# Altium schematic sheet RoBeast_UI.SchDoc: User Interface
size A4; ApprovedBy: CR; DrawnBy: VM & IG; Revision: V1; SheetNumber: 2; SheetTotal: 9
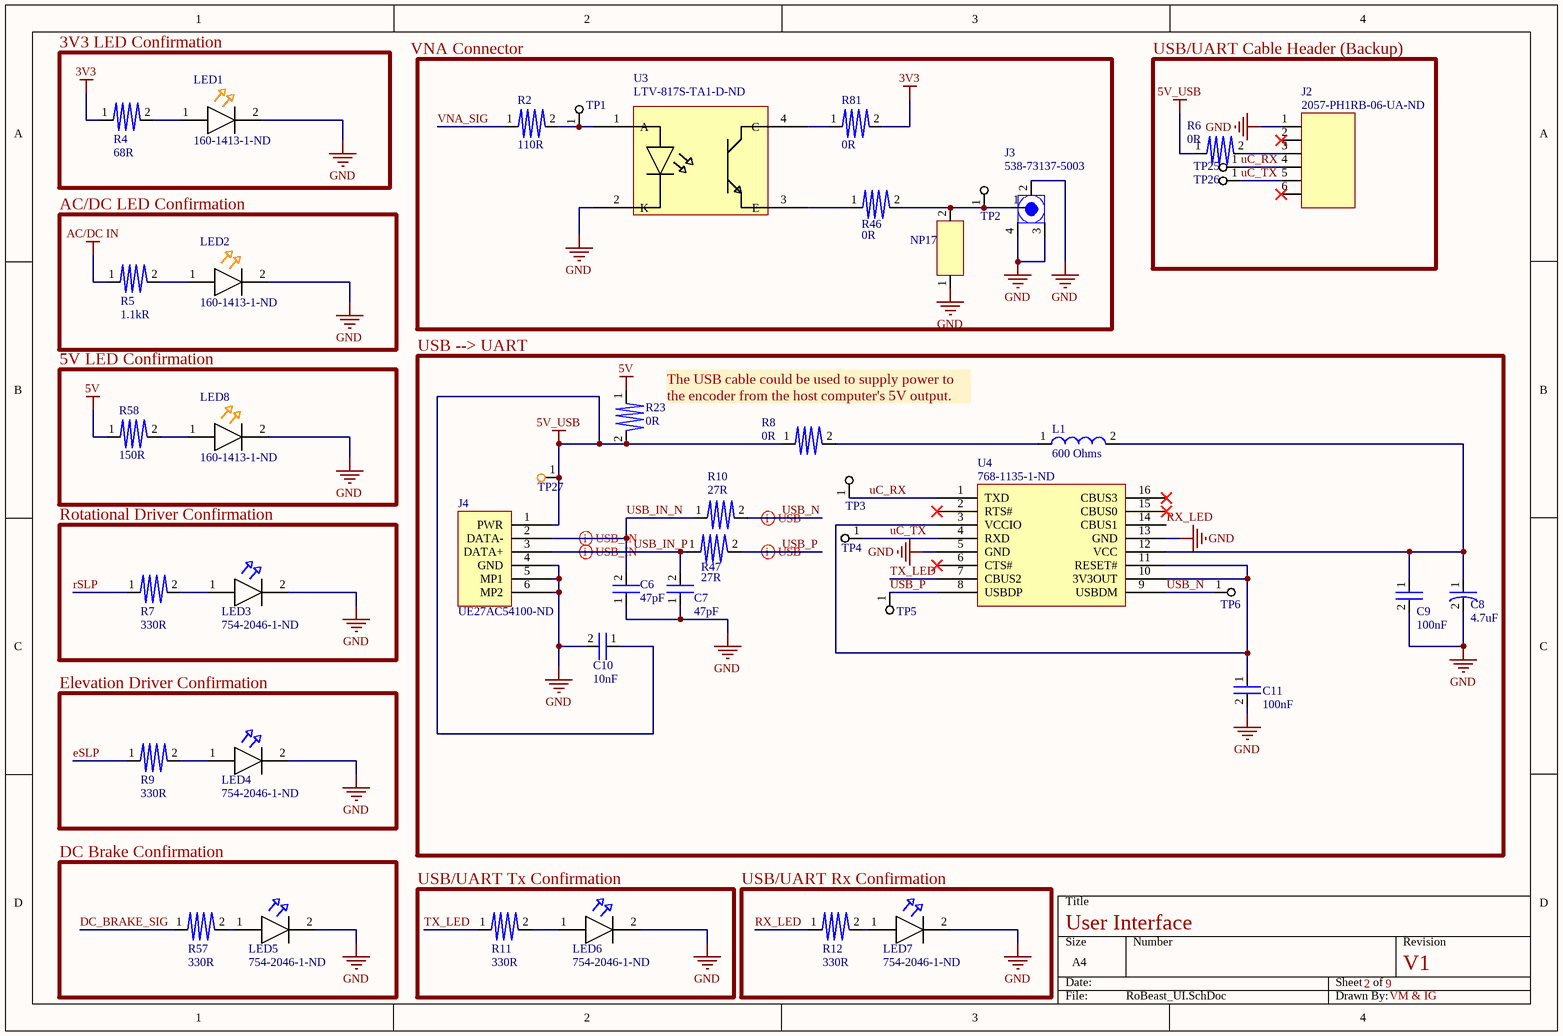
[diagram p0: RoBeast_UI.SchDoc]

## Parts
C6  47pF  [0805]
C7  47pF  [0805]
C8  4.7uF  [EDK475M050A9DAA]
C9  100nF  [0805]
C10  10nF  [0805]
C11  100nF  [0805]
J2  Supplier Part Number 1: 2057-PH1RB-06-UA-ND  [PH1RB-06-UA]  (hidden comment: 6 Pin Connector)
J3  Supplier Part Number 1: 538-73137-5003  [0731375003]  (hidden comment: BNC Connector)
J4  Supplier Part Number 1: UE27AC54100-ND  [UE27AC54100]  (hidden comment: USB Connector)
L1  600 Ohms  [0805]
LED1  Supplier Part Number 1: 160-1413-1-ND  [0805_LED]  (hidden comment: Orange LED)
LED2  Supplier Part Number 1: 160-1413-1-ND  [0805_LED]  (hidden comment: Orange LED)
LED3  Supplier Part Number 1: 754-2046-1-ND  [0805_LED]  (hidden comment: Blue LED)
LED4  Supplier Part Number 1: 754-2046-1-ND  [0805_LED]  (hidden comment: Blue LED)
LED5  Supplier Part Number 1: 754-2046-1-ND  [0805_LED]  (hidden comment: Blue LED)
LED6  Supplier Part Number 1: 754-2046-1-ND  [0805_LED]  (hidden comment: Blue LED)
LED7  Supplier Part Number 1: 754-2046-1-ND  [0805_LED]  (hidden comment: Blue LED)
LED8  Supplier Part Number 1: 160-1413-1-ND  [0805_LED]  (hidden comment: Orange LED)
NP17  Not Populated  [0805]  (value not drawn)
R2  110R  [0805]
R4  68R  [0805]
R5  1.1kR  [0805]
R6  0R  [0805]
R7  330R  [0805]
R8  0R  [0805]
R9  330R  [0805]
R10  27R  [0805]
R11  330R  [0805]
R12  330R  [0805]
R23  0R  [0805]
R46  0R  [0805]
R47  27R  [0805]
R57  330R  [0805]
R58  150R  [0805]
R81  0R  [0805]
TP1  Test Point  [RCWCTE]  (value not drawn)
TP2  Test Point  [RCWCTE]  (value not drawn)
TP3  Test Point  [RCWCTE]  (value not drawn)
TP4  Test Point  [RCWCTE]  (value not drawn)
TP5  Test Point  [RCWCTE]  (value not drawn)
TP6  Test Point  [RCWCTE]  (value not drawn)
TP25  Test Point  [RCWCTE]  (value not drawn)
TP26  Test Point  [RCWCTE]  (value not drawn)
TP27  Test Point  [Test Point]  (value not drawn)
U3  Supplier Part Number 1: LTV-817S-TA1-D-ND  [LTV-817S-TA]  (hidden comment: Optoisolator)
U4  Supplier Part Number 1: 768-1135-1-ND  [FT230XS-R]  (hidden comment: USB/UART Converter)

## Blocks framed on the sheet
3V3 LED Confirmation: LED1 R4
USB/UART Cable Header (Backup): J2 R6 TP25 TP26
AC/DC LED Confirmation: LED2 R5
5V LED Confirmation: LED8 R58
USB --> UART: C6-C11 J4 L1 R8 R10 R23 R47 TP3-TP6 TP27 U4
Rotational Driver Confirmation: LED3 R7
Elevation Driver Confirmation: LED4 R9
DC Brake Confirmation: LED5 R57
USB/UART Tx Confirmation: LED6 R11
USB/UART Rx Confirmation: LED7 R12

## Nets
3V3: R4.1 R81.2
5V: R23.1 R58.1
5V_USB: C10.1 J4.1(PWR) R6.1 R8.1 R23.2 TP27.1
AC/DC IN: R5.1
GND: C6.1 C7.1 C8.2 C9.2 C10.2 C11.2 J2.1 J3.2(GND) J3.3(SUP) J3.4(SUP) J4.4(GND) J4.5(MP1) J4.6(MP2) LED1.2(K) LED2.2(K) LED3.2(K) LED4.2(K) LED5.2(K) LED6.2(K) LED7.2(K) LED8.2(K) NP17.1 U3.2(K) U4.5(GND) U4.13(GND)
DC_BRAKE_SIG: R57.1
eSLP: R9.1
rSLP: R7.1
RX_LED: R12.1 U4.14(CBUS1)
TX_LED: R11.1 U4.7(CBUS2)
uC_RX: J2.4 TP3.1 TP25.1 U4.1(TXD)
uC_TX: J2.5 TP4.1 TP26.1 U4.4(RXD)
USB_IN_N: C6.2 J4.2(DATA-) R10.1
USB_IN_P: C7.2 J4.3(DATA+) R47.1
USB_N: R10.2 TP6.1 U4.9(USBDM)
USB_P: R47.2 TP5.1 U4.8(USBDP)
VNA_SIG: R2.1
NetC8_1: C8.1 C9.1 L1.2 U4.12(VCC)
NetC11_1: C11.1 U4.3(VCCIO) U4.10(3V3OUT) U4.11(RESET#)
NetJ2_3: J2.3 R6.2
NetJ3_1: J3.1(SIGN) NP17.2 R46.2 TP2.1
NetL1_1: L1.1 R8.2
NetLED1_1: LED1.1(A) R4.2
NetLED2_1: LED2.1(A) R5.2
NetLED3_1: LED3.1(A) R7.2
NetLED4_1: LED4.1(A) R9.2
NetLED5_1: LED5.1(A) R57.2
NetLED6_1: LED6.1(A) R11.2
NetLED7_1: LED7.1(A) R12.2
NetLED8_1: LED8.1(A) R58.2
NetR2_2: R2.2 TP1.1 U3.1(A)
NetR46_1: R46.1 U3.3(E)
NetR81_1: R81.1 U3.4(C)

Not connected (* = marked no-connect by the designer): J2 2* 6*; U4 2(RTS#)* 6(CTS#)* 15(CBUS0)* 16(CBUS3)*

## Layout directives
differential pair: USB_IN_N, USB_IN_P, USB_N, USB_P

## Notes on the sheet
- VNA Connector
- The USB cable could be used to supply power to the encoder from the host computer's 5V output.

## Library data of the parts
C6 C7 = C0805C470J5GAC7210: Ceramic Capacitor, Multilayer, Ceramic, 50V, 5% +Tol, 5% -Tol, C0G, 30ppm/Cel TC, 0.000047uF, Surface Mount, 0805; Manufacturer: KEMET; Supplier 1: Digikey; Manufacturer Part Number: C0805C470J5GAC7210; RoHS: Yes; Category: Ceramic Capacitors; Stock 1: 22724; Pricing 1: 1=0.1, 10=0.054, 50=0.031, 100=0.024, 500=0.01802, 1000=0.01417, 2500=0.01288, 5000=0.01185 (USD); Number of Pins: 2; Dielectric Material: Ceramic; Terminal Finish: Nickel; JESD-609 Code: e3; Capacitor Type: Ceramic; Reach SVHC Compliant: Yes; RoHS Compliant: Yes; ComponentLink1URL: https://datasheet.ciiva.com:443/pdfs/VipMasterIC/IC/KEME/KEME-S-A0005605168/KEME-S-A0005605168-1.pdf?src-supplier=IHS+Markit; ComponentLink1Description: https://datasheet.ciiva.com:443/pdfs/VipMasterIC/IC/KEME/KEME-S-A0005605168/KEME-S-A0005605168-1.pdf?src-supplier=IHS+Markit; ComponentLink2URL: https://datasheet.ciiva.com/11646/kem-c1003-c0g-smd-11646575.pdf?src-supplier=Avnet; ComponentLink2Description: https://datasheet.ciiva.com/11646/kem-c1003-c0g-smd-11646575.pdf?src-supplier=Avnet; Supplier Part Number 1: 399-C0805C470J5GAC7210CT-ND
C8 = EDK475M050A9DAA: Aluminum Electrolytic Capacitor, Polarized, Aluminum (wet), 50V, 20% +Tol, 20% -Tol, 4.7uF, Surface Mount, 2121; Manufacturer: KEMET; Dielectric Material: Aluminium; Leakage Current: 3uA; Ripple Current: 23mA; Tan Delta: 0.12; Supplier 1: Digikey; Manufacturer Part Number: EDK475M050A9DAA; RoHS: Yes; Category: Aluminum Electrolytic Capacitors; Stock 1: 9685; Pricing 1: 1=0.7, 10=0.493, 50=0.4154, 100=0.3383, 500=0.2819 (USD); Mount: Surface Mount; Number of Pins: 2; Package Shape: Cylindrical; Size Code: 2621; Min Operating Temperature: -40°C; Max Operating Temperature: 85°C; Polarity: Polarized; Capacitance: 4.7uF; Capacitor Type: Aluminium; Negative Tolerance: 20%; Package Style: SMTMeter; Packaging: Tape and Reel; Positive Tolerance: 20%; Rated DC Voltage (URdc): 50V; Termination: Flat; Length: 6.5mm; Width: 5.3mm; Height: 5.4mm; Reach SVHC Compliant: Yes; RoHS Compliant: Yes; ComponentLink1URL: https://datasheet.ciiva.com:443/pdfs/VipMasterIC/IC/KEME/KEME-S-A0008611145/KEME-S-A0008611145-1.pdf?src-supplier=IHS+Markit; ComponentLink1Description: https://datasheet.ciiva.com:443/pdfs/VipMasterIC/IC/KEME/KEME-S-A0008611145/KEME-S-A0008611145-1.pdf?src-supplier=IHS+Markit; ComponentLink2URL: http://www.mouser.com/ds/2/212/KEM_A4001_EDK-535350.pdf?src-supplier=Mouser; ComponentLink2Description: http://www.mouser.com/ds/2/212/KEM_A4001_EDK-535350.pdf?src-supplier=Mouser; ComponentLink3URL: https://search.kemet.com/component-edge/download/datasheet/EDK475M050A9DAA.pdf?src-supplier=Digikey; ComponentLink3Description: https://search.kemet.com/component-edge/download/datasheet/EDK475M050A9DAA.pdf?src-supplier=Digikey; Supplier Part Number 1: 399-6687-1-ND
C9 C11 = C0805C104J5RAC7800: Ceramic Capacitor, Multilayer, Ceramic, 50V, 5% +Tol, 5% -Tol, X7R, 15% TC, 0.1uF, Surface Mount, 0805; Manufacturer: KEMET; Manufacturer Part Number: C0805C104J5RACTU; Multilayer: Yes; Supplier 1: Digikey; RoHS: Yes; Category: Ceramic Capacitors; Stock 1: 605061; Pricing 1: 1=0.18, 10=0.122, 50=0.0732, 100=0.0576, 500=0.04252, 1000=0.03519 (USD); Mount: Surface Mount; Number of Pins: 2; Dielectric Material: Ceramic; Package Shape: Rectangular; Size Code: 0805; Terminal Finish: Nickel; Min Operating Temperature: -55°C; Max Operating Temperature: 125°C; JESD-609 Code: e3; Capacitor Type: Ceramic; Negative Tolerance: 5%; Packaging: Tape and Reel; Positive Tolerance: 5%; Rated DC Voltage (URdc): 50V; Temperature Characteristics Code: X7R; Termination: Wraparound; Reach SVHC Compliant: Yes; RoHS Compliant: Yes; ComponentLink1URL: http://capacitoredge.kemet.com:80/capedge2/intellispec.jsp?pn=C0805C104J5RACTU&displayPN=C0805C104J5RACTU&src-supplier=IHS+Markit; ComponentLink1Description: http://capacitoredge.kemet.com:80/capedge2/intellispec.jsp?pn=C0805C104J5RACTU&displayPN=C0805C104J5RACTU&src-supplier=IHS+Markit; ComponentLink2URL: https://datasheet.ciiva.com/7842/1732721-7842179.pdf?src-supplier=Element14; ComponentLink2Description: https://datasheet.ciiva.com/7842/1732721-7842179.pdf?src-supplier=Element14; ComponentLink3URL: https://datasheet.ciiva.com/28682/1851736-28682223.pdf?src-supplier=Element14; ComponentLink3Description: https://datasheet.ciiva.com/28682/1851736-28682223.pdf?src-supplier=Element14; ComponentLink4URL: https://datasheet.ciiva.com/7258/1828800-7258413.pdf?src-supplier=Newark; ComponentLink4Description: https://datasheet.ciiva.com/7258/1828800-7258413.pdf?src-supplier=Newark; ComponentLink5URL: https://datasheet.ciiva.com/14589/70095383-14589015.pdf?src-supplier=Allied+Electronics; ComponentLink5Description: https://datasheet.ciiva.com/14589/70095383-14589015.pdf?src-supplier=Allied+Electronics; ComponentLink6URL: https://datasheet.ciiva.com/5417/kem-c1002-x7r-smd-5417352.pdf?src-supplier=Mouser; ComponentLink6Description: https://datasheet.ciiva.com/5417/kem-c1002-x7r-smd-5417352.pdf?src-supplier=Mouser; ComponentLink7URL: https://datasheet.ciiva.com/39122/docfinderpartnumberc0402c102k5ractu-39122924.pdf?src-supplier=Onlinecomponents.com; ComponentLink7Description: https://datasheet.ciiva.com/39122/docfinderpartnumberc0402c102k5ractu-39122924.pdf?src-supplier=Onlinecomponents.com; Supplier Part Number 1: 399-C0805C104J5RAC7800CT-ND; Capacitance: 100nF
C10 = C0805C103J5RAC7210: Ceramic Capacitor, Multilayer, Ceramic, 50V, 5% +Tol, 5% -Tol, X7R, 15% TC, 0.01uF, Surface Mount, 0805; Manufacturer: KEMET; Multilayer: Yes; Supplier 1: Digikey; Manufacturer Part Number: C0805C103J5RAC7210; RoHS: Yes; Category: Ceramic Capacitors; Stock 1: 247971; Pricing 1: 1=0.1, 10=0.059, 50=0.034, 100=0.0263, 500=0.0198, 1000=0.01555, 2500=0.01414, 5000=0.01301 (USD); Mount: Surface Mount; Number of Pins: 2; Dielectric Material: Ceramic; Package Shape: Rectangular; Size Code: 0805; Terminal Finish: Nickel; Min Operating Temperature: -55°C; Max Operating Temperature: 125°C; JESD-609 Code: e3; Capacitance: 10nF; Capacitor Type: Ceramic; Negative Tolerance: 5%; Packaging: Tape and Reel; Positive Tolerance: 5%; Rated DC Voltage (URdc): 50V; Temperature Characteristics Code: X7R; Termination: Wraparound; Reach SVHC Compliant: Yes; RoHS Compliant: Yes; ComponentLink1URL: https://datasheet.ciiva.com:443/pdfs/VipMasterIC/IC/KEME/KEME-S-A0008991654/KEME-S-A0008991654-1.pdf?src-supplier=IHS+Markit; ComponentLink1Description: https://datasheet.ciiva.com:443/pdfs/VipMasterIC/IC/KEME/KEME-S-A0008991654/KEME-S-A0008991654-1.pdf?src-supplier=IHS+Markit; ComponentLink2URL: http://components.arrow.com/part/dataview/3450688S9650973N7429?src-supplier=Arrow+Electronics; ComponentLink2Description: http://components.arrow.com/part/dataview/3450688S9650973N7429?src-supplier=Arrow+Electronics; ComponentLink3URL: http://www.mouser.com/ds/2/212/KEM_C1002_X7R_SMD-1102033.pdf?src-supplier=Mouser; ComponentLink3Description: http://www.mouser.com/ds/2/212/KEM_C1002_X7R_SMD-1102033.pdf?src-supplier=Mouser; ComponentLink4URL: https://api.kemet.com/component-edge/download/datasheet/C0805C103J5RAC7210.pdf?src-supplier=Digikey; ComponentLink4Description: https://api.kemet.com/component-edge/download/datasheet/C0805C103J5RAC7210.pdf?src-supplier=Digikey; Supplier Part Number 1: 399-17616-1-ND
J2 = PH1RB-06-UA: Conn Unshrouded Header HDR 6 POS 2.54mm Solder RA Thru-Hole; Manufacturer: Adam Equipment; Supplier 1: Digikey; Manufacturer Part Number: PH1RB-06-UA; RoHS: No; Category: Connectors; Stock 1: 9095; Pricing 1: 1=0.18, 10=0.141, 100=0.104, 500=0.08606, 1000=0.0753, 5000=0.06454, 10000=0.06275 (USD)
J3 = 0731375003: RF BNC Connector, 1 Contact(s), Female, Panel Mount, Board Mount, Solder Terminal, Locking, Receptacle; Manufacturer: Molex; Manufacturer Part Number: 73137-5003; Manufacturer Series: 73137; Option: General Purpose; Characteristic Impedance: 50R; Coupling Type: Bayonet; Filter Feature: No; Panel Mount: Yes; Contact Resistance: 1.5mR; Contact Style: Coax; Dielectric Withstanding Voltage (AC): 2.1kV; Durability: 500Cycles; Insertion Loss: 0.2dB; Insulation Resistance: 5GR; Mating Information: MULTIPLE MATING PARTS AVAILABLE; Number of Ports: 1; Operating Frequency-Max: 4kHz; VSWR: 1.3; Body Breadth: 0.52inch; Body Depth: 1.385inch; Body Length: 0.581inch; Reference Standard: UL; Supplier 1: Mouser; RoHS: Yes; Category: RF / Coaxial Connectors; Stock 1: 2215; Pricing 1: 1=4.82, 10=4.24, 50=4.24, 100=3.37, 1000=2.79, 10000=2.6 (USD); Mount: Board; Contact Finish - Mating: NOT SPECIFIED; Insulation Color: Black; Insulation Material: Polypropylene; Shell Finish: Nickel; Shell Material: Zinc; Connector Type: BNC; Body/Shell Style: RECEPTACLE; Contact Gender: Female; Mounting Style: RIGHT ANGLE; Termination: Solder; Number of Contacts: 1; Mounting Option 1: LOCKING; Terminal Length: 0.163inch; RoHS Compliant: Yes; DIN Conformance: No; IEC Conformance: No; MIL Conformance: No; Reach SVHC Compliant: No; ComponentLink1URL: https://datasheet.ciiva.com:443/pdfs/VipMasterIC/IC/MOLE/MOLES59426/MOLES59426-1.pdf?src-supplier=IHS+Markit; ComponentLink1Description: https://datasheet.ciiva.com:443/pdfs/VipMasterIC/IC/MOLE/MOLES59426/MOLES59426-1.pdf?src-supplier=IHS+Markit; ComponentLink2URL: https://datasheet.ciiva.com/19460/1976769-19460336.pdf?src-supplier=Jameco; ComponentLink2Description: https://datasheet.ciiva.com/19460/1976769-19460336.pdf?src-supplier=Jameco; ComponentLink3URL: https://datasheet.ciiva.com/5176/0731375003-rf-coax-connectors-173113-5176792.pdf?src-supplier=Mouser; ComponentLink3Description: https://datasheet.ciiva.com/5176/0731375003-rf-coax-connectors-173113-5176792.pdf?src-supplier=Mouser; ComponentLink4URL: https://datasheet.ciiva.com/15172/getdatasheetpartid-42660-15172351.pdf?src-supplier=Verical; ComponentLink4Description: https://datasheet.ciiva.com/15172/getdatasheetpartid-42660-15172351.pdf?src-supplier=Verical; ComponentLink5URL: https://datasheet.ciiva.com/16080/1194240731375003-rf-coax-nectors-16080996.pdf?src-supplier=Onlinecomponents.com; ComponentLink5Description: https://datasheet.ciiva.com/16080/1194240731375003-rf-coax-nectors-16080996.pdf?src-supplier=Onlinecomponents.com; ComponentLink6URL: https://datasheet.ciiva.com/22826/0900766b810de4ef-22826921.pdf?src-supplier=Rs; ComponentLink6Description: https://datasheet.ciiva.com/22826/0900766b810de4ef-22826921.pdf?src-supplier=Rs
J4 = UE27AC54100: Conn USB 2.0 Type A RCP 4 POS 2mm/2.5mm Solder RA Thru-Hole 4 Terminal 1 Port; Manufacturer: Amphenol ICC / FCI; Supplier 1: Digikey; Manufacturer Part Number: UE27AC54100; RoHS: No; Category: USB Connectors; Stock 1: 20038; Pricing 1: 1=0.75, 10=0.633, 25=0.6072, 40=0.5945, 120=0.56858, 240=0.51692, 480=0.46523, 960=0.41353, 2400=0.37477 (USD)
L1 = MI0805K601R-10: Ferrite Chip, 1 Function(s), 1.5A, 2 Pin(s); Manufacturer: Laird; DC Resistance-Max: 100mR; Number of Functions: 1; Output Impedance: 600R; Max Frequency: 100MHz; Supplier 1: Digikey; Manufacturer Part Number: MI0805K601R-10; RoHS: Yes; Category: Ferrite Beads and Chips; Stock 1: 475960; Pricing 1: 1=0.19, 10=0.147, 25=0.122, 50=0.1052, 100=0.0948, 250=0.08004, 500=0.0716, 1000=0.06107 (USD); Mount: Surface Mount; Terminal Finish: Nickel; Material: Ferrite; Case Code: 0805; Min Operating Temperature: -55°C; Max Operating Temperature: 125°C; JESD-609 Code: e3; Filter Type: FERRITE CHIP; Manufacturer Series: MI0805K601R; Current Rating: 1.5A; Packaging: Tape and Reel; Construction: Chip Bead; Min Frequency: 100MHz; Series: MI0805K601R-10; Length: 2mm; Width: 1.25mm; Height: 0.9mm; RoHS Compliant: Yes; Reach SVHC Compliant: Yes; ComponentLink1URL: https://datasheet.ciiva.com:443/pdfs/VipMasterIC/IC/STWD/STWDS00462/STWDS00462-1.pdf?src-supplier=IHS+Markit; ComponentLink1Description: https://datasheet.ciiva.com:443/pdfs/VipMasterIC/IC/STWD/STWDS00462/STWDS00462-1.pdf?src-supplier=IHS+Markit; ComponentLink2URL: https://datasheet.ciiva.com/22650/1685918-22650417.pdf?src-supplier=Element14; ComponentLink2Description: https://datasheet.ciiva.com/22650/1685918-22650417.pdf?src-supplier=Element14; ComponentLink3URL: https://datasheet.ciiva.com/1013/mi0805k601r-10-b-1013299.pdf?src-supplier=Digikey; ComponentLink3Description: https://datasheet.ciiva.com/1013/mi0805k601r-10-b-1013299.pdf?src-supplier=Digikey; ComponentLink4URL: https://datasheet.ciiva.com/3082/mi0805k601r-10-a-vp-3082219.pdf?src-supplier=Avnet; ComponentLink4Description: https://datasheet.ciiva.com/3082/mi0805k601r-10-a-vp-3082219.pdf?src-supplier=Avnet; Supplier Part Number 1: 240-2390-1-ND
LED1 LED2 LED8 = LTST-C170KFKT: Single Color LED, Orange, Water Clear, 1.4mm; Manufacturer: Vishay Lite-On; Shape: Rectangular; Forward Current-Max: 30mA; Luminous Intensity-Nom: 60mcd; Number of Functions: 1; Viewing Angle: 130°; Forward Voltage-Max: 2.4V; Reverse Voltage-Max: 5V; Overall Height: 1.1mm; Supplier 1: Digikey; Manufacturer Part Number: LTST-C170KFKT; RoHS: Yes; Category: LEDs; Stock 1: 182565; Pricing 1: 1=0.28, 10=0.152, 100=0.0706, 500=0.06514, 1000=0.05103 (USD); Mount: Surface Mount; Number of Pins: 2; Color: Orange; Terminal Finish: Tin; Color@wavelength: Orange; Min Operating Temperature: -55°C; Max Operating Temperature: 85°C; Lens Style: WATER CLEAR; Optoelectronic Device Type: SINGLE COLOR LED; Packaging: Tape and Reel; JESD-609 Code: e3; Size: 1.4mm; Terminal Pitch: 2.1mm; Reach SVHC Compliant: Yes; RoHS Compliant: Yes; ComponentLink1URL: https://datasheet.ciiva.com:443/pdfs/VipMasterIC/IC/LITE/LITE-S-A0009745864/LITE-S-A0009746003-1.pdf?src-supplier=IHS+Markit; ComponentLink1Description: https://datasheet.ciiva.com:443/pdfs/VipMasterIC/IC/LITE/LITE-S-A0009745864/LITE-S-A0009746003-1.pdf?src-supplier=IHS+Markit; ComponentLink2URL: https://datasheet.ciiva.com/11773/0900766b80dc0279-11773662.pdf?src-supplier=Rs; ComponentLink2Description: https://datasheet.ciiva.com/11773/0900766b80dc0279-11773662.pdf?src-supplier=Rs; ComponentLink3URL: https://datasheet.ciiva.com/12403/lite-on-ltst-c170kfkt-187690-12403821.pdf?src-supplier=Mouser; ComponentLink3Description: https://datasheet.ciiva.com/12403/lite-on-ltst-c170kfkt-187690-12403821.pdf?src-supplier=Mouser; ComponentLink4URL: https://datasheet.ciiva.com/15117/getdatasheetpartid-158266-15117926.pdf?src-supplier=Verical; ComponentLink4Description: https://datasheet.ciiva.com/15117/getdatasheetpartid-158266-15117926.pdf?src-supplier=Verical; ComponentLink5URL: https://datasheet.ciiva.com/2110/s-110-ltst-c170kfkt-2110076.pdf?src-supplier=Digikey; ComponentLink5Description: https://datasheet.ciiva.com/2110/s-110-ltst-c170kfkt-2110076.pdf?src-supplier=Digikey; ComponentLink6URL: https://datasheet.ciiva.com/2110/s-110-ltst-c170kfkt-2110075.pdf?src-supplier=Digikey; ComponentLink6Description: https://datasheet.ciiva.com/2110/s-110-ltst-c170kfkt-2110075.pdf?src-supplier=Digikey; ComponentLink7URL: https://datasheet.ciiva.com/2110/s-110-ltst-c170kfkt-2110077.pdf?src-supplier=Digikey; ComponentLink7Description: https://datasheet.ciiva.com/2110/s-110-ltst-c170kfkt-2110077.pdf?src-supplier=Digikey; ComponentLink8URL: https://datasheet.ciiva.com/16427/ltst-c170kfkt-16427484.pdf?src-supplier=Future+Electronics; ComponentLink8Description: https://datasheet.ciiva.com/16427/ltst-c170kfkt-16427484.pdf?src-supplier=Future+Electronics
LED3-LED7 = APTD2012LQBC/D: Single Color LED; Manufacturer: Kingbright; Supplier 1: Digikey; Manufacturer Part Number: APTD2012LQBC/D; RoHS: Yes; Category: LEDs; Stock 1: 20866; Pricing 1: 1=0.54, 10=0.358, 100=0.2367, 1000=0.18275 (USD); RoHS Compliant: Yes; ComponentLink1URL: https://datasheet.ciiva.com:443/pdfs/VipMasterIC/IC/KBEC/KBEC-S-A0008946974/KBEC-S-A0008947044-1.pdf?src-supplier=IHS+Markit; ComponentLink1Description: https://datasheet.ciiva.com:443/pdfs/VipMasterIC/IC/KBEC/KBEC-S-A0008946974/KBEC-S-A0008947044-1.pdf?src-supplier=IHS+Markit; ComponentLink2URL: http://www.kingbrightusa.com/images/catalog/SPEC/APTD2012LQBC-D.pdf?src-supplier=Digikey; ComponentLink2Description: http://www.kingbrightusa.com/images/catalog/SPEC/APTD2012LQBC-D.pdf?src-supplier=Digikey
NP17 = NP
R2 = AC0805FR-07110RL: Fixed Resistor, Metal Glaze/thick Film, 0.125W, 110ohm, 150V, 1% +/-Tol, 100ppm/Cel, Surface Mount, 0805; Manufacturer: Yageo; Additional Feature: LASER TRIMMABLE; Rated Power Dissipation (P): 125mW; Rated Temperature: 70°C; Temperature Coefficient: 100ppm/°C; Package Height: 0.5mm; Package Length: 2mm; Package Width: 1.25mm; Reference Standard: AEC-Q200; Supplier 1: Digikey; Manufacturer Part Number: AC0805FR-07110RL; RoHS: Yes; Category: Chip SMD Resistors; Stock 1: 9650; Pricing 1: 1=0.1, 10=0.031, 50=0.0198, 100=0.0166, 500=0.01152, 1000=0.00997 (USD); Mount: Surface Mount; Number of Pins: 2; Package Shape: Rectangular; Size Code: 0805; Terminal Finish: Nickel; Min Operating Temperature: -55°C; Max Operating Temperature: 155°C; Tolerance: 1%; JESD-609 Code: e3; Resistor Type: FIXED RESISTOR; Construction: Chip; Package Style: SMTMeter; Packaging: Tape and Reel; Resistance: 110R; Technology: METAL GLAZE/THICK FILM; Termination: Wraparound; Working Voltage: 150V; Reach SVHC Compliant: Yes; RoHS Compliant: Yes; ComponentLink1URL: https://datasheet.ciiva.com:443/pdfs/VipMasterIC/IC/YAGO/YAGO-S-A0003597364/YAGO-S-A0003597364-1.pdf?src-supplier=IHS+Markit; ComponentLink1Description: https://datasheet.ciiva.com:443/pdfs/VipMasterIC/IC/YAGO/YAGO-S-A0003597364/YAGO-S-A0003597364-1.pdf?src-supplier=IHS+Markit; ComponentLink2URL: http://www.mouser.com/ds/2/447/yageodocoutput-1111992.pdf?src-supplier=Mouser; ComponentLink2Description: http://www.mouser.com/ds/2/447/yageodocoutput-1111992.pdf?src-supplier=Mouser; ComponentLink3URL: http://www.yageo.com/documents/recent/PYu-AC_51_RoHS_L_2.pdf?src-supplier=Future+Electronics; ComponentLink3Description: http://www.yageo.com/documents/recent/PYu-AC_51_RoHS_L_2.pdf?src-supplier=Future+Electronics; ComponentLink4URL: http://www.yageo.com/NewPortal/yageodocoutput?fileName=/pdf/R-Chip/PYu-AC_51_RoHS_L_6.pdf&src-supplier=Digikey; ComponentLink4Description: http://www.yageo.com/NewPortal/yageodocoutput?fileName=/pdf/R-Chip/PYu-AC_51_RoHS_L_6.pdf&src-supplier=Digikey; Supplier Part Number 1: 13-AC0805FR-07110RLCT-ND
R4 = RC0805FR-0768RL: Fixed Resistor, Metal Glaze/thick Film, 0.125W, 68ohm, 150V, 1% +/-Tol, 100ppm/Cel, Surface Mount, 0805; Manufacturer: Yageo; Additional Feature: LASER TRIMMABLE; Rated Power Dissipation (P): 125mW; Rated Temperature: 70°C; Temperature Coefficient: 100ppm/°C; Package Height: 0.5mm; Package Length: 2mm; Package Width: 1.25mm; Supplier 1: Digikey; Manufacturer Part Number: RC0805FR-0768RL; RoHS: Yes; Category: Chip SMD Resistors; Stock 1: 141090; Pricing 1: 1=0.1, 10=0.025, 50=0.016, 100=0.0133, 500=0.00912, 1000=0.00787 (USD); Mount: Surface Mount; Number of Pins: 2; Package Shape: Rectangular; Size Code: 0805; Terminal Finish: Nickel; Min Operating Temperature: -55°C; Max Operating Temperature: 155°C; Tolerance: 1%; JESD-609 Code: e3; Resistor Type: FIXED RESISTOR; Construction: Chip; Package Style: SMTMeter; Packaging: Tape and Reel; Resistance: 68R; Technology: METAL GLAZE/THICK FILM; Termination: Wraparound; Working Voltage: 150V; Reach SVHC Compliant: Yes; RoHS Compliant: Yes; ComponentLink1URL: https://datasheet.ciiva.com:443/pdfs/VipMasterIC/IC/YAGO/YAGO-S-A0008145938/YAGO-S-A0008145938-1.pdf?src-supplier=IHS+Markit; ComponentLink1Description: https://datasheet.ciiva.com:443/pdfs/VipMasterIC/IC/YAGO/YAGO-S-A0008145938/YAGO-S-A0008145938-1.pdf?src-supplier=IHS+Markit; ComponentLink2URL: https://datasheet.ciiva.com/2458/pyu-r-int-thick-7-2458140.pdf?src-supplier=Digikey; ComponentLink2Description: https://datasheet.ciiva.com/2458/pyu-r-int-thick-7-2458140.pdf?src-supplier=Digikey; ComponentLink3URL: https://datasheet.ciiva.com/2458/pyu-r-int-thick-7-2458141.pdf?src-supplier=Digikey; ComponentLink3Description: https://datasheet.ciiva.com/2458/pyu-r-int-thick-7-2458141.pdf?src-supplier=Digikey; ComponentLink4URL: https://datasheet.ciiva.com/2458/pyu-r-int-thick-7-2458139.pdf?src-supplier=Digikey; ComponentLink4Description: https://datasheet.ciiva.com/2458/pyu-r-int-thick-7-2458139.pdf?src-supplier=Digikey; ComponentLink5URL: https://datasheet.ciiva.com/7941/444164-7941831.pdf?src-supplier=Element14; ComponentLink5Description: https://datasheet.ciiva.com/7941/444164-7941831.pdf?src-supplier=Element14; ComponentLink6URL: https://datasheet.ciiva.com/16744/rc0805-16744519.pdf?src-supplier=Future+Electronics; ComponentLink6Description: https://datasheet.ciiva.com/16744/rc0805-16744519.pdf?src-supplier=Future+Electronics; ComponentLink7URL: https://datasheet.ciiva.com/12666/rc0805-12666940.pdf?src-supplier=Mouser; ComponentLink7Description: https://datasheet.ciiva.com/12666/rc0805-12666940.pdf?src-supplier=Mouser; ComponentLink8URL: https://datasheet.ciiva.com/7941/444164-7941832.pdf?src-supplier=Element14; ComponentLink8Description: https://datasheet.ciiva.com/7941/444164-7941832.pdf?src-supplier=Element14; Supplier Part Number 1: 311-68.0CRCT-ND
R5 = RCS08051K10FKEA: Fixed Resistor, Metal Glaze/thick Film, 0.4W, 1100ohm, 150V, 1% +/-Tol, 100ppm/Cel, Surface Mount, 0805; Manufacturer: Vishay Dale; Supplier 1: Digikey; Manufacturer Part Number: RCS08051K10FKEA; RoHS: Yes; Category: Chip SMD Resistors; Stock 1: 9985; Pricing 1: 1=0.2, 10=0.104, 50=0.0712, 100=0.0613, 500=0.045, 1000=0.03986 (USD); ComponentLink1URL: https://datasheet.ciiva.com:443/pdfs/VipMasterIC/IC/VISH/VISH-S-A0007978036/VISH-S-A0007978036-1.pdf?src-supplier=IHS+Markit; ComponentLink1Description: https://datasheet.ciiva.com:443/pdfs/VipMasterIC/IC/VISH/VISH-S-A0007978036/VISH-S-A0007978036-1.pdf?src-supplier=IHS+Markit; ComponentLink2URL: http://www.vishay.com/docs/20065/rcse3.pdf?src-supplier=Digikey; ComponentLink2Description: http://www.vishay.com/docs/20065/rcse3.pdf?src-supplier=Digikey; Supplier Part Number 1: 541-RCS08051K10FKEACT-ND
R6 R8 R23 R46 R81 = RMCF0805ZT0R00: Fixed Resistor, Metal Glaze/thick Film, 0.125W, 0ohm, Surface Mount, 0805; Manufacturer: Stackpole Electronics; Rated Power Dissipation (P): 125mW; Rated Temperature: 70°C; Working Voltage: 150V; Package Height: 0.5mm; Package Length: 2mm; Package Width: 1.25mm; Reference Standard: AEC-Q200; Supplier 1: Digikey; Manufacturer Part Number: RMCF0805ZT0R00; RoHS: Yes; Category: Chip SMD Resistors; Stock 1: 1154169; Pricing 1: 1=0.1, 10=0.017, 25=0.0128, 50=0.0096, 100=0.0068, 250=0.00544, 500=0.00436, 1000=0.00321 (USD); Mount: Surface Mount; Number of Pins: 2; Package Shape: Rectangular; Size Code: 0805; Terminal Finish: Nickel; Min Operating Temperature: -55°C; Max Operating Temperature: 155°C; JESD-609 Code: e3; Resistor Type: FIXED RESISTOR; Construction: Rectangular; Package Style: SMTMeter; Packaging: Tape and Reel; Resistance: 0R; Technology: METAL GLAZE/THICK FILM; Termination: Wraparound; Reach SVHC Compliant: Yes; RoHS Compliant: Yes; ComponentLink1URL: https://datasheet.ciiva.com:443/pdfs/VipMasterIC/IC/SEIE/SEIE-S-A0007077258/SEIE-S-A0007077258-1.pdf?src-supplier=IHS+Markit; ComponentLink1Description: https://datasheet.ciiva.com:443/pdfs/VipMasterIC/IC/SEIE/SEIE-S-A0007077258/SEIE-S-A0007077258-1.pdf?src-supplier=IHS+Markit; ComponentLink2URL: https://datasheet.ciiva.com/15193/getdatasheetpartid-360417-15193658.pdf?src-supplier=Verical; ComponentLink2Description: https://datasheet.ciiva.com/15193/getdatasheetpartid-360417-15193658.pdf?src-supplier=Verical; Supplier Part Number 1: RMCF0805ZT0R00CT-ND
R7 R9 R11 R12 R57 = RC0805FR-13330RL: Fixed Resistor, Metal Glaze/thick Film, 0.125W, 330ohm, 150V, 1% +/-Tol, 100ppm/Cel, Surface Mount, 0805; Manufacturer: Yageo; Additional Feature: LASER TRIMMABLE; Rated Power Dissipation (P): 125mW; Rated Temperature: 70°C; Temperature Coefficient: 100ppm/°C; Package Height: 0.5mm; Package Length: 2mm; Package Width: 1.25mm; Supplier 1: Digikey; Manufacturer Part Number: RC0805FR-13330RL; RoHS: Yes; Category: Chip SMD Resistors; Stock 1: 36292; Pricing 1: 1=0.1, 10=0.025, 50=0.016, 100=0.0133, 500=0.00912, 1000=0.00787, 5000=0.00577, 10000=0.00511 (USD); Mount: Surface Mount; Number of Pins: 2; Package Shape: Rectangular; Size Code: 0805; Terminal Finish: Nickel; Min Operating Temperature: -55°C; Max Operating Temperature: 155°C; Tolerance: 1%; JESD-609 Code: e3; Resistor Type: FIXED RESISTOR; Construction: Chip; Package Style: SMTMeter; Packaging: Tape and Reel; Resistance: 330R; Technology: METAL GLAZE/THICK FILM; Termination: Wraparound; Working Voltage: 150V; Reach SVHC Compliant: Yes; RoHS Compliant: Yes; ComponentLink1URL: https://datasheet.ciiva.com:443/pdfs/VipMasterIC/IC/YAGO/YAGO-S-A0008145938/YAGO-S-A0008145938-1.pdf?src-supplier=IHS+Markit; ComponentLink1Description: https://datasheet.ciiva.com:443/pdfs/VipMasterIC/IC/YAGO/YAGO-S-A0008145938/YAGO-S-A0008145938-1.pdf?src-supplier=IHS+Markit; ComponentLink2URL: https://datasheet.ciiva.com/12575/rc0805-257173-12575525.pdf?src-supplier=Mouser; ComponentLink2Description: https://datasheet.ciiva.com/12575/rc0805-257173-12575525.pdf?src-supplier=Mouser; Supplier Part Number 1: 13-RC0805FR-13330RLCT-ND
R10 R47 = SG73P2ATTD27R0F: Fixed Resistor, Metal Glaze/thick Film, 0.5W, 27ohm, 400V, 1% +/-Tol, 200ppm/Cel, Surface Mount, 0805; Manufacturer: KOA Speer; Rated Power Dissipation (P): 250mW; Rated Temperature: 70°C; Temperature Coefficient: 200ppm/°C; Package Height: 0.5mm; Package Length: 2mm; Package Width: 1.25mm; Reference Standard: AEC-Q200; Supplier 1: Digikey; Manufacturer Part Number: SG73P2ATTD27R0F; RoHS: Yes; Category: Chip SMD Resistors; Stock 1: 9351; Pricing 1: 1=0.18, 10=0.09, 50=0.0602, 100=0.0514, 500=0.03686, 1000=0.03245 (USD); Mount: Surface Mount; Number of Pins: 2; Size Code: 0805; Terminal Finish: Nickel; Min Operating Temperature: -55°C; Max Operating Temperature: 155°C; Tolerance: 1%; JESD-609 Code: e3; Resistor Type: FIXED RESISTOR; Construction: Rectangular; Package Style: SMTMeter; Packaging: Tape and Reel; Resistance: 27R; Technology: METAL GLAZE/THICK FILM; Termination: Wraparound; Working Voltage: 400V; Reach SVHC Compliant: Yes; RoHS Compliant: Yes; ComponentLink1URL: https://datasheet.ciiva.com:443/pdfs/VipMasterIC/IC/KOAS/KOAS-S-A0009586268/KOAS-S-A0009586268-1.pdf?src-supplier=IHS+Markit; ComponentLink1Description: https://datasheet.ciiva.com:443/pdfs/VipMasterIC/IC/KOAS/KOAS-S-A0009586268/KOAS-S-A0009586268-1.pdf?src-supplier=IHS+Markit; ComponentLink2URL: http://www.koaspeer.com/catimages/Products/SG73/SG73.pdf?src-supplier=Mouser; ComponentLink2Description: http://www.koaspeer.com/catimages/Products/SG73/SG73.pdf?src-supplier=Mouser; Supplier Part Number 1: 2019-SG73P2ATTD27R0FCT-ND
R58 = CRGP0805F150R: Fixed Resistor, Metal Glaze/thick Film, 0.33W, 150ohm, 150V, 1% +/-Tol, 100ppm/Cel, Surface Mount, 0805; Manufacturer: TE Connectivity; Supplier 1: Digikey; Manufacturer Part Number: CRGP0805F150R; RoHS: Yes; Category: Chip SMD Resistors; Stock 1: 37582; Pricing 1: 1=0.17, 10=0.086, 50=0.0576, 100=0.0492, 500=0.0353, 1000=0.03107 (USD); Number of Pins: 2; Resistor Type: FIXED RESISTOR; Reach SVHC Compliant: Yes; RoHS Compliant: Yes; ComponentLink1URL: https://datasheet.ciiva.com:443/pdfs/VipMasterIC/IC/TYEL/TYEL-S-A0005460475/TYEL-S-A0005460475-1.pdf?src-supplier=IHS+Markit; ComponentLink1Description: https://datasheet.ciiva.com:443/pdfs/VipMasterIC/IC/TYEL/TYEL-S-A0005460475/TYEL-S-A0005460475-1.pdf?src-supplier=IHS+Markit; ComponentLink2URL: https://www.te.com/commerce/DocumentDelivery/DDEController?Action=srchrtrv&amp;DocNm=9-1773463-9&amp;DocType=DS&amp;DocLang=English&src-supplier=Digikey; ComponentLink2Description: https://www.te.com/commerce/DocumentDelivery/DDEController?Action=srchrtrv&amp;DocNm=9-1773463-9&amp;DocType=DS&amp;DocLang=English&src-supplier=Digikey; Supplier Part Number 1: A130467CT-ND
TP1-TP6 TP25 TP26 = RCWCTE: Testing/Accessories; Manufacturer: KOA Speer; Rated Temperature: 70°C; Resistance: 0R; Package Height: 2mm; Package Length: 3.2mm; Package Width: 1.6mm; Reference Standard: AEC-Q200; Supplier 1: Digikey; Manufacturer Part Number: RCWCTE; RoHS: Yes; Category: Chip SMD Resistors; Stock 1: 132357; Pricing 1: 1=0.16, 10=0.137, 25=0.1212, 50=0.1132, 100=0.105, 250=0.09292, 500=0.08888, 1000=0.07272 (USD); Mount: Surface Mount; Number of Pins: 2; Package Shape: Rectangular; Size Code: 1206; Terminal Finish: Copper; Min Operating Temperature: -55°C; Max Operating Temperature: 125°C; JESD-609 Code: e2; Resistor Type: FIXED RESISTOR; Construction: Chip; Package Style: SMTMeter; Packaging: Tape and Reel; Termination: Wraparound; Reach SVHC Compliant: Yes; RoHS Compliant: Yes; ComponentLink1URL: https://datasheet.ciiva.com:443/pdfs/VipMasterIC/IC/KOAS/KOASS03065/KOASS03065-1.pdf?src-supplier=IHS+Markit; ComponentLink1Description: https://datasheet.ciiva.com:443/pdfs/VipMasterIC/IC/KOAS/KOASS03065/KOASS03065-1.pdf?src-supplier=IHS+Markit; ComponentLink2URL: https://datasheet.ciiva.com/34302/1876186-34302940.pdf?src-supplier=Jameco; ComponentLink2Description: https://datasheet.ciiva.com/34302/1876186-34302940.pdf?src-supplier=Jameco; ComponentLink3URL: https://datasheet.ciiva.com/5556/rc-5556236.pdf?src-supplier=Mouser; ComponentLink3Description: https://datasheet.ciiva.com/5556/rc-5556236.pdf?src-supplier=Mouser; ComponentLink4URL: https://datasheet.ciiva.com/26821/getdatasheetpartid-110197-26821157.pdf?src-supplier=Verical; ComponentLink4Description: https://datasheet.ciiva.com/26821/getdatasheetpartid-110197-26821157.pdf?src-supplier=Verical; Supplier Part Number 1: 2019-RCWCTECT-ND
U3 = LTV-817S-TA: Transistor Output Optocoupler, 1-Element, 5000V Isolation; Manufacturer: Vishay Lite-On; Manufacturer Part Number: LTV-817S-TA1-D; Supplier 1: Digikey; RoHS: Yes; Category: Optocouplers; Stock 1: 11000; Pricing 1: 1000=0.1201, 2000=0.11009, 5000=0.10008, 10000=0.09341, 25000=0.09007, 50000=0.08688 (USD); ComponentLink1URL: https://datasheet.ciiva.com/12240/ltv-817-827-847-12240455.pdf?src-supplier=Mouser; ComponentLink1Description: https://datasheet.ciiva.com/12240/ltv-817-827-847-12240455.pdf?src-supplier=Mouser; ComponentLink2URL: https://datasheet.ciiva.com/2958/s-110-ltv-817m-s-s-ta-s-ta1-s-tpseries20130925-2958798.pdf?src-supplier=Digikey; ComponentLink2Description: https://datasheet.ciiva.com/2958/s-110-ltv-817m-s-s-ta-s-ta1-s-tpseries20130925-2958798.pdf?src-supplier=Digikey
U4 = FT230XS-R: Microprocessor Circuit, CMOS, PDSO16; Manufacturer: FTDI; Package Body Material: Plastic; Package Equivalence Code: SSOP16,.25; Power Supplies: 1.8/3.3,3.3/5V; Max Supply Voltage: 5.5V; Min Supply Voltage: 2.97V; Supply Voltage-Nom: 5V; Time @ Peak Reflow Temperature-Max (s): 40s; Qualification Status: Not Qualified; Supplier 1: Digikey; Manufacturer Part Number: FT230XS-R; RoHS: Yes; Category: Interface ICs; Stock 1: 39349; Pricing 1: 1=2.26, 25=2.19, 100=2.12, 250=1.93, 500=1.7625 (USD); Package Code: SSOP; Number of Pins: 16; Package Shape: Rectangular; Min Operating Temperature: -40°C; Max Operating Temperature: 85°C; JESD-30 Code: R-PDSO-G16; Moisture Sensitivity Level: 3; Package Style: SMALL OUTLINE, SHRINK PITCHMeter; Peak Reflow Temperature (Cel): 260°C; Surface Mount: Yes; Technology: CMOS; Terminal Form: Gull Wing; Terminal Position: DUAL; Length: 4.9mm; Width: 3.91mm; Height - Seated (Max): 1.75mm; Terminal Pitch: 0.635mm; Temperature Grade: INDUSTRIAL; Reach SVHC Compliant: Yes; RoHS Compliant: Yes; ComponentLink1URL: https://datasheet.ciiva.com:443/pdfs/VipMasterIC/IC/FTDI/FTDI-S-A0001962455/FTDI-S-A0001962455-1.pdf?src-supplier=IHS+Markit; ComponentLink1Description: https://datasheet.ciiva.com:443/pdfs/VipMasterIC/IC/FTDI/FTDI-S-A0001962455/FTDI-S-A0001962455-1.pdf?src-supplier=IHS+Markit; ComponentLink2URL: https://datasheet.ciiva.com/30478/0900766b811020cb-30478167.pdf?src-supplier=Rs; ComponentLink2Description: https://datasheet.ciiva.com/30478/0900766b811020cb-30478167.pdf?src-supplier=Rs; ComponentLink3URL: https://datasheet.ciiva.com/4787/ds-ft230x-5395-4787571.pdf?src-supplier=Mouser; ComponentLink3Description: https://datasheet.ciiva.com/4787/ds-ft230x-5395-4787571.pdf?src-supplier=Mouser; ComponentLink4URL: https://datasheet.ciiva.com/1787/ds-ft230x-1787315.pdf?src-supplier=Digikey; ComponentLink4Description: https://datasheet.ciiva.com/1787/ds-ft230x-1787315.pdf?src-supplier=Digikey; ComponentLink5URL: https://datasheet.ciiva.com/1787/ft-x-series-1787316.pdf?src-supplier=Digikey; ComponentLink5Description: https://datasheet.ciiva.com/1787/ft-x-series-1787316.pdf?src-supplier=Digikey; ComponentLink6URL: https://datasheet.ciiva.com/1787/ft-x-series-1787317.pdf?src-supplier=Digikey; ComponentLink6Description: https://datasheet.ciiva.com/1787/ft-x-series-1787317.pdf?src-supplier=Digikey